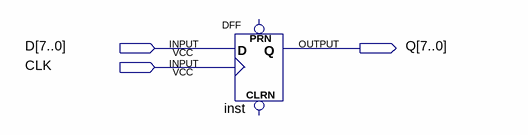
[diagram p0: schematic sheet]
// Quartus schematic RE.bdf as structural Verilog: 1 symbols, 3 pins
module RE (
  input  [7:0] D,
  input  CLK,
  output [7:0] Q
);

  DFF inst[7:0] (.CLK(CLK), .D(D), .Q(Q));  // open: CLRN, PRN
endmodule
